# Altium schematic sheet Driver Board.SchDoc
size A3; SheetNumber: 11; SheetTotal: 12
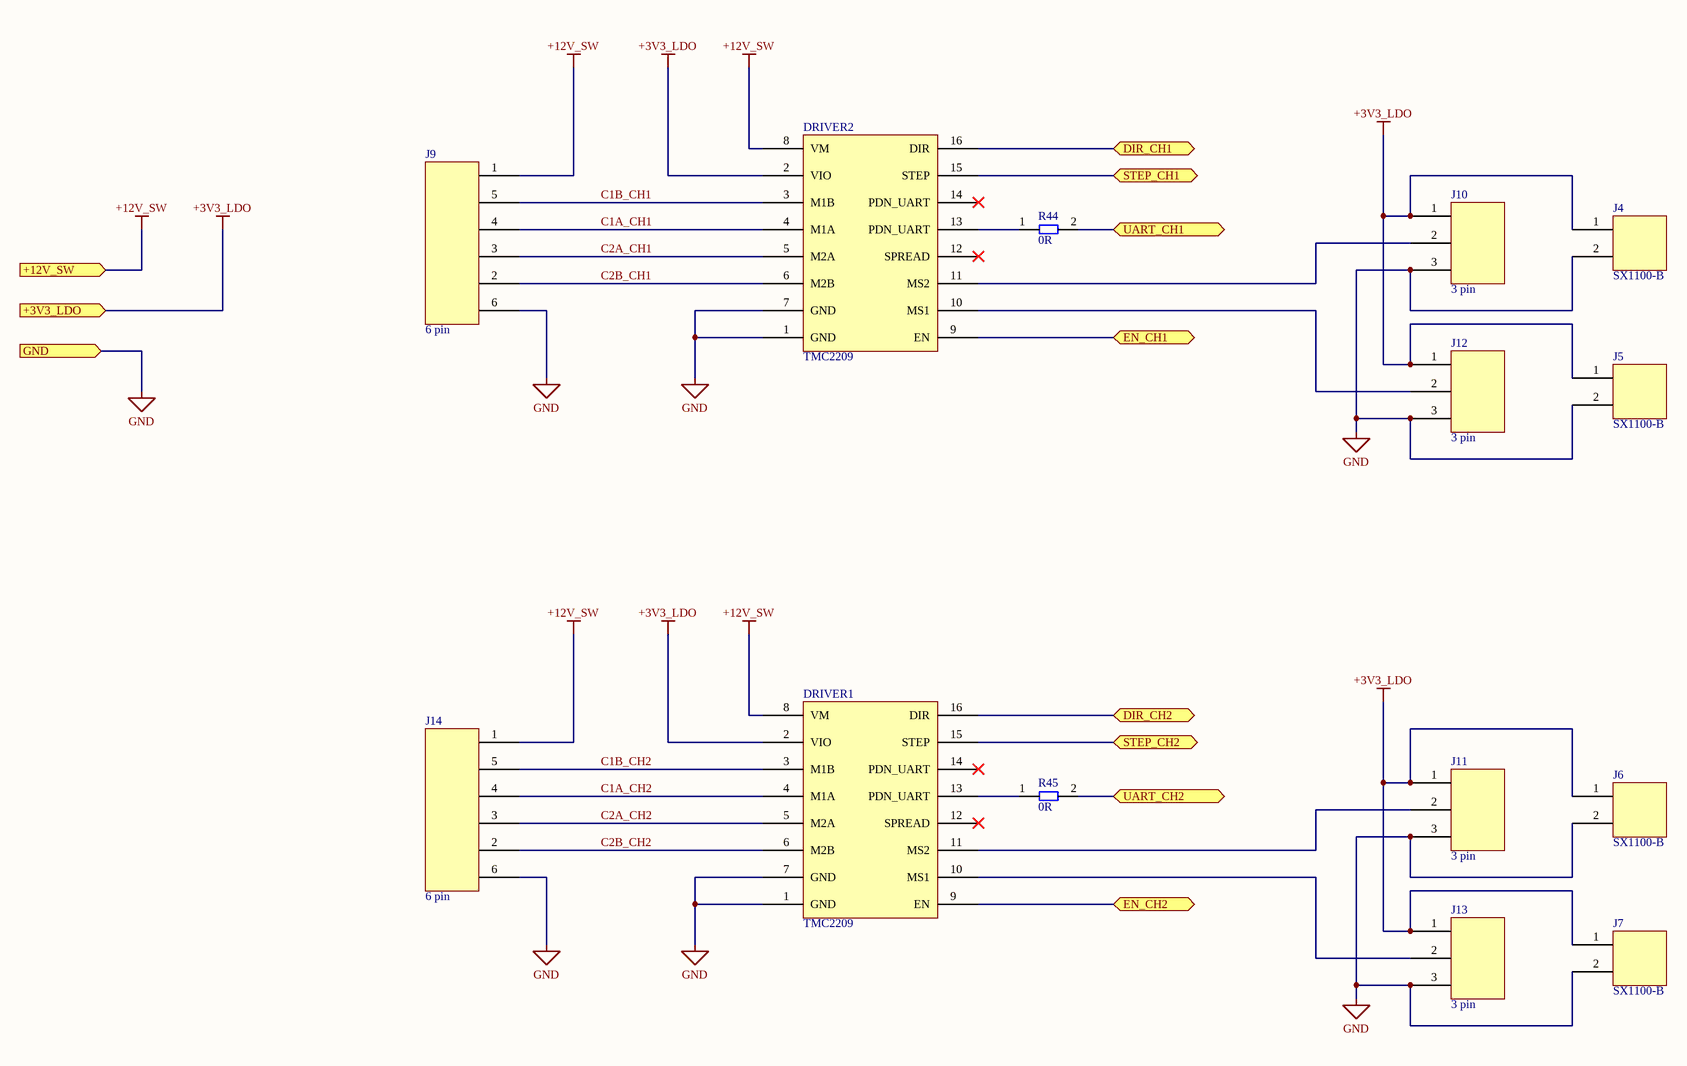
[diagram p0: Driver Board.SchDoc]

## Parts
DRIVER1  TMC2209  [TMC2209]
DRIVER2  TMC2209  [TMC2209]
J4  SX1100-B
J5  SX1100-B
J6  SX1100-B
J7  SX1100-B
J9  6 pin  [6 pin terminal 5 mm]
J10  3 pin  [3 pin header]
J11  3 pin  [3 pin header]
J12  3 pin  [3 pin header]
J13  3 pin  [3 pin header]
J14  6 pin  [6 pin terminal 5 mm]
R44  0R  [0805 Resistor - IPC A]
R45  0R  [0805 Resistor - IPC A]

## Ports
+3V3_LDO (in, see Callisto Control Board[4B], 3V3 LDO[3B], BME280[2B], INA219_CH1[1A], INA219_CH2[1B], INA219_CH3[1B], INA219_CH4[1B], INA219_CH5[1B], INA219_CH6[1B]), +12V_SW (in, see Callisto Control Board[3C], 5V_SMPS[2B]), DIR_CH1 (bidir, see Callisto Control Board[3B]), DIR_CH2 (bidir, see Callisto Control Board[3B]), EN_CH1 (bidir, see Callisto Control Board[3B]), EN_CH2 (bidir, see Callisto Control Board[3B]), GND (in, see Callisto Control Board[3C], 3V3 LDO[3B], BME280[3B], INA219_CH1[1A], INA219_CH2[1B], INA219_CH3[1B], INA219_CH4[1B], INA219_CH5[1B], INA219_CH6[1B], Raspberry Pi[1C]), STEP_CH1 (bidir, see Callisto Control Board[3B]), STEP_CH2 (bidir, see Callisto Control Board[3B]), UART_CH1 (bidir, see Callisto Control Board[3B]), UART_CH2 (bidir, see Callisto Control Board[3B])

## Nets
+3V3_LDO: DRIVER1.2(VIO) DRIVER2.2(VIO) J4.1 J5.1 J6.1 J7.1 J10.1 J11.1 J12.1 J13.1 ; port +3V3_LDO
+12V_SW: DRIVER1.8(VM) DRIVER2.8(VM) J9.1 J14.1 ; port +12V_SW
GND: DRIVER1.1(GND) DRIVER1.7(GND) DRIVER2.1(GND) DRIVER2.7(GND) J4.2 J5.2 J6.2 J7.2 J9.6 J10.3 J11.3 J12.3 J13.3 J14.6 ; port GND
C1A_CH1: DRIVER2.4(M1A) J9.4
C1A_CH2: DRIVER1.4(M1A) J14.4
C1B_CH1: DRIVER2.3(M1B) J9.5
C1B_CH2: DRIVER1.3(M1B) J14.5
C2A_CH1: DRIVER2.5(M2A) J9.3
C2A_CH2: DRIVER1.5(M2A) J14.3
C2B_CH1: DRIVER2.6(M2B) J9.2
C2B_CH2: DRIVER1.6(M2B) J14.2
DIR_CH1: DRIVER2.16(DIR) ; port DIR_CH1
DIR_CH2: DRIVER1.16(DIR) ; port DIR_CH2
EN_CH1: DRIVER2.9(EN) ; port EN_CH1
EN_CH2: DRIVER1.9(EN) ; port EN_CH2
STEP_CH1: DRIVER2.15(STEP) ; port STEP_CH1
STEP_CH2: DRIVER1.15(STEP) ; port STEP_CH2
UART_CH1: R44.2 ; port UART_CH1
UART_CH2: R45.2 ; port UART_CH2
NetDRIVER1_10: DRIVER1.10(MS1) J13.2
NetDRIVER1_11: DRIVER1.11(MS2) J11.2
NetDRIVER1_13: DRIVER1.13(PDN_UART) R45.1
NetDRIVER2_10: DRIVER2.10(MS1) J12.2
NetDRIVER2_11: DRIVER2.11(MS2) J10.2
NetDRIVER2_13: DRIVER2.13(PDN_UART) R44.1

Not connected (* = marked no-connect by the designer): DRIVER1 12(SPREAD)* 14(PDN_UART)*; DRIVER2 12(SPREAD)* 14(PDN_UART)*

## Library data of the parts
DRIVER1 DRIVER2 = TMC2209: TMC2209 FET based stepper motor driver board
J4 = Header Jumper: Headers & Wire Housings SHUNT OPEN T BLK / Jumper / SX1100-B
J5-J7 = Header Jumper: Headers & Wire Housings SHUNT OPEN T BLK / SX1100-B
J9 J14 = 6 pin terminal block 5 mm
J10-J13 = 3 pin male header 0.254mm
R44 R45 = RC0805JR-070RL: Thick Film Resistors - SMD 0 Ohms 125 mW 0805 5% / RC0805JR-070RL